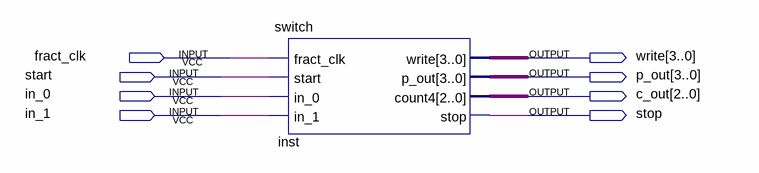
[diagram p0: schematic sheet]
// Quartus schematic switch_sim.bdf as structural Verilog: 1 symbols, 8 pins
module switch_sim (
  input  fract_clk,
  input  start,
  input  in_0,
  input  in_1,
  output [3:0] write,
  output [3:0] p_out,
  output [2:0] c_out,
  output stop
);

  switch inst (
    .fract_clk(fract_clk), .start(start), .in_0(in_0), .in_1(in_1), .write(write), .p_out(p_out),
    .count4(c_out), .stop(stop));
endmodule
